# Altium schematic sheet 舵机控制_Sheet1.SchDoc
size A4
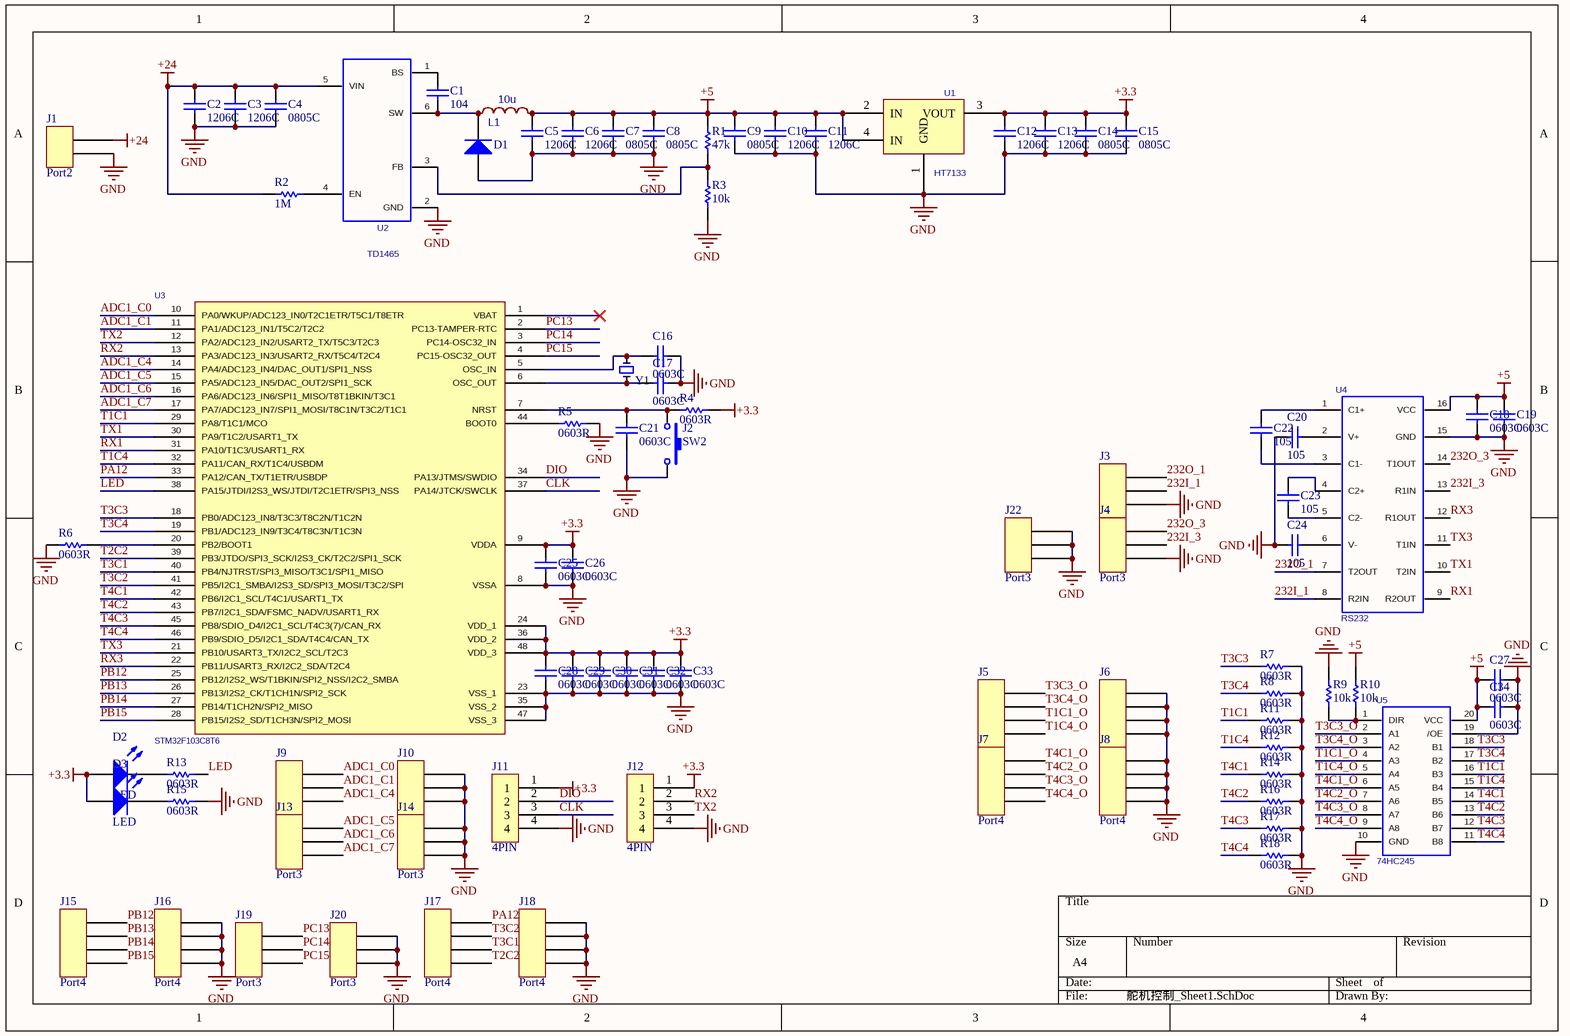
[diagram p0: 舵机控制_Sheet1.SchDoc]

## Parts
C1  104  [0603C]
C2  1206C  [1206C]
C3  1206C  [1206C]
C4  0805C  [0805C]
C5  1206C  [1206C]
C6  1206C  [1206C]
C7  0805C  [0805C]
C8  0805C  [0805C]
C9  0805C  [0805C]
C10  1206C  [1206C]
C11  1206C  [1206C]
C12  1206C  [1206C]
C13  1206C  [1206C]
C14  0805C  [0805C]
C15  0805C  [0805C]
C16  0603C  [0603C]
C17  0603C  [0603C]
C18  0603C  [0603C]
C19  0603C  [0603C]
C20  105  [0603C]
C21  0603C  [0603C]
C22  105  [0603C]
C23  105  [0603C]
C24  105  [0603C]
C25  0603C  [0603C]
C26  0603C  [0603C]
C27  0603C  [0603C]
C28  0603C  [0603C]
C29  0603C  [0603C]
C30  0603C  [0603C]
C31  0603C  [0603C]
C32  0603C  [0603C]
C33  0603C  [0603C]
C34  0603C  [0603C]
D1  Diode 1N914  [SOD-123_L2.8-W1.8-LS3.7-RD]  (value not drawn)
D2  LED  [0603LED]
D3  LED  [0603LED]
J1  Port2  [Port2]
J2  SW2  [KEY-SMD_L6.2-W3.6-LS8.0]
J3  Port3  [Port3]
J4  Port3  [Port3]
J5  Port4  [Port4]
J6  Port4  [Port4]
J7  Port4  [Port4]
J8  Port4  [Port4]
J9  Port3  [Port3]
J10  Port3  [Port3]
J11  4PIN  [4PIN]
J12  4PIN  [4PIN]
J13  Port3  [Port3]
J14  Port3  [Port3]
J15  Port4  [Port4]
J16  Port4  [Port4]
J17  Port4  [Port4]
J18  Port4  [Port4]
J19  Port3  [Port3]
J20  Port3  [Port3]
J22  Port3  [Port3]
L1  10u  [L-SMD-0630]
R1  47k  [0603R]
R2  1M  [0603R]
R3  10k  [0603R]
R4  0603R  [0603R]
R5  0603R  [0603R]
R6  0603R  [0603R]
R7  0603R  [0603R]
R8  0603R  [0603R]
R9  10k  [0603R]
R10  10k  [0603R]
R11  0603R  [0603R]
R12  0603R  [0603R]
R13  0603R  [0603R]
R14  0603R  [0603R]
R15  0603R  [0603R]
R16  0603R  [0603R]
R17  0603R  [0603R]
R18  0603R  [0603R]
U1  HT7133  [SOT-89-3_L4.5-W2.5-P1.50-LS4.2-BR]
U2  TD1465  [SOT-23-6]
U3  STM32F103C8T6  [LQFP-48_L7.0-W7.0-P0.50-LS9.0-BL]
U4  RS232  [SOP-16_L9.9-W3.9-P1.27-LS6.1-BL]
U5  74HC245  [TSSOP-20_L6.5-W4.4-P0.65-LS6.4-BL]
Y1  XTAL  [XTAL]  (value not drawn)

## Nets
+3.3: C12.2 C13.2 C14.2 C15.2 C25.2 C26.2 C28.2 C29.2 C30.2 C31.2 C32.2 C33.2 D2.1(A) D3.1(A) J11.1 J12.1 R4.1 U1.3(VOUT) U3.9(VDDA) U3.24(VDD_1) U3.36(VDD_2) U3.48(VDD_3)
+5: C5.2 C6.2 C7.2 C8.2 C9.2 C10.2 C11.2 C18.2 C19.2 C27.2 C34.2 L1.2 R1.2 R10.2 U1.2(IN) U1.4(IN) U4.16(VCC) U5.20(VCC)
+24: C2.2 C3.2 C4.2 J1.2 R2.1 U2.5(VIN)
GND: C2.1 C3.1 C4.1 C5.1 C6.1 C7.1 C8.1 C9.1 C10.1 C11.1 C12.1 C13.1 C14.1 C15.1 C16.2 C17.2 C18.1 C19.1 C20.2 C21.1 C24.2 C25.1 C26.1 C27.1 C28.1 C29.1 C30.1 C31.1 C32.1 C33.1 C34.1 D1.1(A) J1.1 J2.2 J3.3 J4.3 J6.1 J6.2 J6.3 J6.4 J8.1 J8.2 J8.3 J8.4 J10.1 J10.2 J10.3 J11.4 J12.4 J14.1 J14.2 J14.3 J16.1 J16.2 J16.3 J16.4 J18.1 J18.2 J18.3 J18.4 J20.1 J20.2 J20.3 J22.1 J22.2 J22.3 R3.1 R5.1 R6.1 R7.2 R8.2 R9.2 R11.2 R12.2 R14.2 R15.2 R16.2 R17.2 R18.2 U1.1(GND) U2.2(GND) U3.8(VSSA) U3.23(VSS_1) U3.35(VSS_2) U3.47(VSS_3) U4.15(GND) U5.10(GND) U5.19(/OE)
232I_1: J3.2 U4.8(R2IN)
232I_3: J4.2 U4.13(R1IN)
232O_1: J3.1 U4.7(T2OUT)
232O_3: J4.1 U4.14(T1OUT)
ADC1_C0: J9.1 U3.10(PA0/WKUP/ADC123_IN0/T2C1ETR/T5C1/T8ETR)
ADC1_C1: J9.2 U3.11(PA1/ADC123_IN1/T5C2/T2C2)
ADC1_C4: J9.3 U3.14(PA4/ADC123_IN4/DAC_OUT1/SPI1_NSS)
ADC1_C5: J13.1 U3.15(PA5/ADC123_IN5/DAC_OUT2/SPI1_SCK)
ADC1_C6: J13.2 U3.16(PA6/ADC123_IN6/SPI1_MISO/T8T1BKIN/T3C1)
ADC1_C7: J13.3 U3.17(PA7/ADC123_IN7/SPI1_MOSI/T8C1N/T3C2/T1C1)
CLK: J11.3 U3.37(PA14/JTCK/SWCLK)
DIO: J11.2 U3.34(PA13/JTMS/SWDIO)
LED: R13.2 U3.38(PA15/JTDI/I2S3_WS/JTDI/T2C1ETR/SPI3_NSS)
PA12: J17.1 U3.33(PA12/CAN_TX/T1ETR/USBDP)
PB12: J15.1 U3.25(PB12/I2S2_WS/T1BKIN/SPI2_NSS/I2C2_SMBA)
PB13: J15.2 U3.26(PB13/I2S2_CK/T1CH1N/SPI2_SCK)
PB14: J15.3 U3.27(PB14/T1CH2N/SPI2_MISO)
PB15: J15.4 U3.28(PB15/I2S2_SD/T1CH3N/SPI2_MOSI)
PC13: J19.1 U3.2(PC13-TAMPER-RTC)
PC14: J19.2 U3.3(PC14-OSC32_IN)
PC15: J19.3 U3.4(PC15-OSC32_OUT)
RX1: U3.31(PA10/T1C3/USART1_RX) U4.9(R2OUT)
RX2: J12.2 U3.13(PA3/ADC123_IN3/USART2_RX/T5C4/T2C4)
RX3: U3.22(PB11/USART3_RX/I2C2_SDA/T2C4) U4.12(R1OUT)
T1C1: R11.1 U3.29(PA8/T1C1/MCO) U5.16(B3)
T1C1_O: J5.3 U5.4(A3)
T1C4: R12.1 U3.32(PA11/CAN_RX/T1C4/USBDM) U5.15(B4)
T1C4_O: J5.4 U5.5(A4)
T2C2: J17.4 U3.39(PB3/JTDO/SPI3_SCK/I2S3_CK/T2C2/SPI1_SCK)
T3C1: J17.3 U3.40(PB4/NJTRST/SPI3_MISO/T3C1/SPI1_MISO)
T3C2: J17.2 U3.41(PB5/I2C1_SMBA/I2S3_SD/SPI3_MOSI/T3C2/SPI)
T3C3: R7.1 U3.18(PB0/ADC123_IN8/T3C3/T8C2N/T1C2N) U5.18(B1)
T3C3_O: J5.1 U5.2(A1)
T3C4: R8.1 U3.19(PB1/ADC123_IN9/T3C4/T8C3N/T1C3N) U5.17(B2)
T3C4_O: J5.2 U5.3(A2)
T4C1: R14.1 U3.42(PB6/I2C1_SCL/T4C1/USART1_TX) U5.14(B5)
T4C1_O: J7.1 U5.6(A5)
T4C2: R16.1 U3.43(PB7/I2C1_SDA/FSMC_NADV/USART1_RX) U5.13(B6)
T4C2_O: J7.2 U5.7(A6)
T4C3: R17.1 U3.45(PB8/SDIO_D4/I2C1_SCL/T4C3(7)/CAN_RX) U5.12(B7)
T4C3_O: J7.3 U5.8(A7)
T4C4: R18.1 U3.46(PB9/SDIO_D5/I2C1_SDA/T4C4/CAN_TX) U5.11(B8)
T4C4_O: J7.4 U5.9(A8)
TX1: U3.30(PA9/T1C2/USART1_TX) U4.10(T2IN)
TX2: J12.3 U3.12(PA2/ADC123_IN2/USART2_TX/T5C3/T2C3)
TX3: U3.21(PB10/USART3_TX/I2C2_SCL/T2C3) U4.11(T1IN)
NetC1_1: C1.1 D1.2(K) L1.1 U2.6(SW)
NetC1_2: C1.2 U2.1(BS)
NetC16_1: C16.1 U3.5(OSC_IN) Y1.2
NetC17_1: C17.1 U3.6(OSC_OUT) Y1.1
NetC20_1: C20.1 U4.2(V+)
NetC21_2: C21.2 J2.1 R4.2 U3.7(NRST)
NetC22_1: C22.1 U4.3(C1-)
NetC22_2: C22.2 U4.1(C1+)
NetC23_1: C23.1 U4.5(C2-)
NetC23_2: C23.2 U4.4(C2+)
NetC24_1: C24.1 U4.6(V-)
NetD2_2: D2.2(K) R13.1
NetD3_2: D3.2(K) R15.1
NetR1_1: R1.1 R3.2 U2.3(FB)
NetR2_2: R2.2 U2.4(EN)
NetR5_2: R5.2 U3.44(BOOT0)
NetR6_2: R6.2 U3.20(PB2/BOOT1)
NetR9_1: R9.1 R10.1 U5.1(DIR)

Not connected (* = marked no-connect by the designer): U3 1(VBAT)*

## Library data of the parts
C1 C16-C34 = 0603C: Value: 100pF; Published: 8-Jun-2000; LatestRevisionDate: 17-Jul-2002; LatestRevisionNote: Re-released for DXP Platform.; PackageReference: RAD-0.3; Publisher: Altium Limited; PackageDescription: Radial Cap, Thru-Hole; 2 Leads; 0.3 in Pin Spacing
L1 = L: BOM_Manufacturer: cjiang; BOM_Manufacturer Part: FXL0630-100-M; nameAlias: Inductance; Contributor: LCSC; BOM_Paste Type: expand; BOM_Assembly Type: smtWeld; BOM_Supplier: LCSC; BOM_Supplier Part: C167223; spicePre: L; spiceSymbolName: FXL0630-100-M
R1-R3 R9 R10 = 0603R: Published: 8-Jun-2000; LatestRevisionDate: 17-Jul-2002; LatestRevisionNote: Re-released for DXP Platform.; PackageReference: AXIAL-0.3; Publisher: Altium Limited; PackageDescription: Axial Device, Thru-Hole; 2 Leads; 0.3 in Pin Spacing
U3 = STM32F103C8T6: PCB DECAL: LQFP-48_M; Comment_1: STM32F103C
D1 = Diode 1N914: Published: 8-Jun-2000; LatestRevisionDate: 17-Jul-2002; LatestRevisionNote: Re-released for DXP Platform.; DatasheetVersion: 1997; PackageReference: DO-35; Publisher: Altium Limited; PackageDescription: Diode, Axial; Body 3.8 x 1.9 mm (LxDia. max), Lead Dia. 0.53 mm (max); Code_JEDEC: DO-204-AH; ComponentLink1Description: Manufacturer Link; ComponentLink1URL: http://www.fairchildsemi.com/; ComponentLink2Description: Datasheet; ComponentLink2URL: http://www.fairchildsemi.com/ds/1N%2F1N4448.pdf
D2 D3 = LED: Published: 8-Jun-2000; LatestRevisionDate: 08-Jul-2005; LatestRevisionNote: Mech Layer 1 removed.; PackageReference: LED-0; Publisher: Altium Limited; PackageDescription: LED; 2 Leads
J2 = SW2: Published: 24-Mar-1999; LatestRevisionDate: 17-Jul-2002; LatestRevisionNote: Re-released for DXP Platform.; PackageReference: SPST-2; Publisher: Altium Limited; PackageDescription: Switch; 2 Leads
R4-R8 R11-R18 = 0603R: Published: 8-Jun-2000; LatestRevisionDate: 17-Jul-2002; LatestRevisionNote: Re-released for DXP Platform.; PackageReference: AXIAL-0.3; Publisher: Altium Limited; PackageDescription: Axial Device, Thru-Hole; 2 Leads; 0.3 in Pin Spacing
U1 = HT7133: PCB DECAL: SOT-89-3_L4.5-W2.5-P1.50-LS4.2-BR
U2 = TD1465: PCB DECAL: SOT-23-6
U4 = RS232: PCB DECAL: SOP-16_L9.9-W3.9-P1.27-LS6.1-BL
U5 = 74HC245: PCB DECAL: TSSOP-20_L6.5-W4.4-P0.65-LS6.4-BL